# Altium schematic sheet SensorIn.SchDoc
size A4
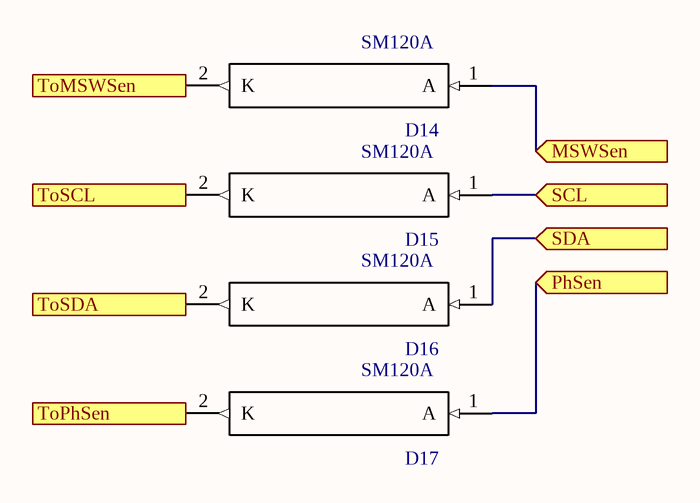
[diagram p0: SensorIn.SchDoc]

## Parts
D14  SM120A  [*DIOM5227X270N_S1M(Primary)]
D15  SM120A  [*DIOM5227X270N_S1M(Primary)]
D16  SM120A  [*DIOM5227X270N_S1M(Primary)]
D17  SM120A  [*DIOM5227X270N_S1M(Primary)]

## Ports
MSWSen (in), PhSen (in), SCL (in), SDA (in), ToMSWSen (out), ToPhSen (out), ToSCL (out), ToSDA (out)

## Nets
MSWSen: D14.1(A) ; port MSWSen
PhSen: D17.1(A) ; port PhSen
SCL: D15.1(A) ; port SCL
SDA: D16.1(A) ; port SDA
ToMSWSen: D14.2(K) ; port ToMSWSen
ToPhSen: D17.2(K) ; port ToPhSen
ToSCL: D15.2(K) ; port ToSCL
ToSDA: D16.2(K) ; port ToSDA

## Notes on the sheet
- Title
- Size:
- Date:
- A4
- Number:
- Time:
- Revision:
- Sheet
- of
- File:

## Library data of the parts
D14-D17 = STPS2L60A: SCHOTTKY RECTIFIER 2A; Voltage Vrrm: 60V; Diode Case Style: DO-214AC; Case Style: DO-214AC; pin to pad: 1>A 2>A; MF: STMicroelectronics; Price: None; Availability: Unavailable; SnapEDA_Link: https://www.snapeda.com/parts/STPS2L60A/STMicroelectronics/view-part/?ref=snap; Package: DO-214 STMicroelectronics; MP: STPS2L60A; Value: *